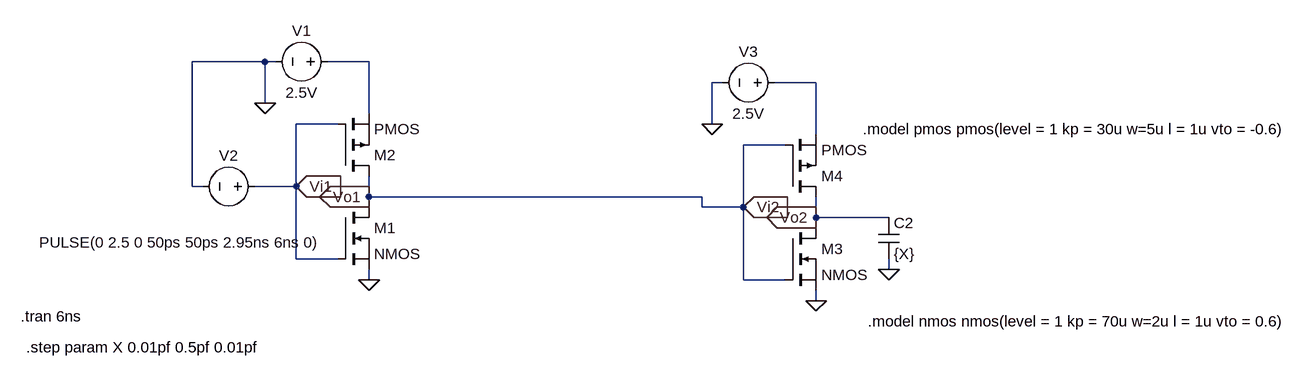
[diagram p0: schematic Draft5.asc]
Draft5.asc, the LTspice schematic file:
Version 4
SHEET 1 1324 680
WIRE -368 -160 -480 -160
WIRE -352 -160 -368 -160
WIRE -208 -160 -272 -160
WIRE 336 -128 320 -128
WIRE 480 -128 416 -128
WIRE -368 -96 -368 -160
WIRE -208 -80 -208 -160
WIRE -256 -64 -320 -64
WIRE 320 -64 320 -128
WIRE 480 -48 480 -128
WIRE 432 -32 368 -32
WIRE -480 32 -480 -160
WIRE -464 32 -480 32
WIRE -320 32 -320 -64
WIRE -320 32 -384 32
WIRE -208 48 -208 16
WIRE 304 48 -208 48
WIRE -208 64 -208 48
WIRE 304 64 304 48
WIRE 368 64 368 -32
WIRE 368 64 304 64
WIRE 480 80 480 48
WIRE 592 80 480 80
WIRE 480 96 480 80
WIRE -320 144 -320 32
WIRE -256 144 -320 144
WIRE 592 160 592 144
WIRE -208 176 -208 160
WIRE 368 176 368 64
WIRE 432 176 368 176
WIRE 480 208 480 192
FLAG -208 176 0
FLAG -368 -96 0
FLAG -320 32 Vi1
IOPIN -320 32 In
FLAG -208 48 Vo1
IOPIN -208 48 Out
FLAG 480 208 0
FLAG 320 -64 0
FLAG 592 160 0
FLAG 368 64 Vi2
IOPIN 368 64 In
FLAG 480 80 Vo2
IOPIN 480 80 Out
SYMBOL nmos -256 64 R0
SYMATTR InstName M1
SYMBOL pmos -256 16 M180
SYMATTR InstName M2
SYMBOL voltage -256 -160 R90
WINDOW 0 -32 56 VBottom 2
WINDOW 3 32 56 VTop 2
SYMATTR InstName V1
SYMATTR Value 2.5V
SYMBOL voltage -368 32 R90
WINDOW 0 -32 56 VBottom 2
WINDOW 3 71 131 VTop 2
WINDOW 123 0 0 Left 2
WINDOW 39 0 0 Left 2
SYMATTR InstName V2
SYMATTR Value PULSE(0 2.5 0 50ps 50ps 2.95ns 6ns 0)
SYMBOL nmos 432 96 R0
SYMATTR InstName M3
SYMBOL pmos 432 48 M180
SYMATTR InstName M4
SYMBOL voltage 432 -128 R90
WINDOW 0 -32 56 VBottom 2
WINDOW 3 32 56 VTop 2
SYMATTR InstName V3
SYMATTR Value 2.5V
SYMBOL cap 576 80 R0
SYMATTR InstName C2
SYMATTR Value {X}
TEXT -744 232 Left 2 !.tran 6ns
TEXT 560 240 Left 2 !.model nmos nmos(level = 1 kp = 70u w=2u l = 1u vto = 0.6)
TEXT 552 -56 Left 2 !.model pmos pmos(level = 1 kp = 30u w=5u l = 1u vto = -0.6)
TEXT -736 280 Left 2 !.step param X 0.01pf 0.5pf 0.01pf

The netlist it stands for:
* Draft5.asc
M1 Vi2 Vi1 0 0 NMOS
M2 Vi2 Vi1 N001 N001 PMOS
V1 N001 0 2.5V
V2 Vi1 0 PULSE(0 2.5 0 50ps 50ps 2.95ns 6ns 0)
M3 Vo2 Vi2 0 0 NMOS
M4 Vo2 Vi2 N002 N002 PMOS
V3 N002 0 2.5V
C2 Vo2 0 {X}
.model NMOS NMOS
.model PMOS PMOS
.lib standard.mos
.tran 6ns
.model nmos nmos(level = 1 kp = 70u w=2u l = 1u vto = 0.6)
.model pmos pmos(level = 1 kp = 30u w=5u l = 1u vto = -0.6)
.step param X 0.01pf 0.5pf 0.01pf
.backanno
.end